# Altium schematic sheet pca10040_sheet5_power_supply.SchDoc: PCA10040 - Power Supply
size A4; Revision: 1.1.1; SheetNumber: 5; SheetTotal: 5; DrawnBy: KJP; ProjectNumber: 4397; PCBRevision: 0071KJP; DocumentSize: A4; PCAName: PCA10040; PCBNumber: 400150; ProjectName: Quark
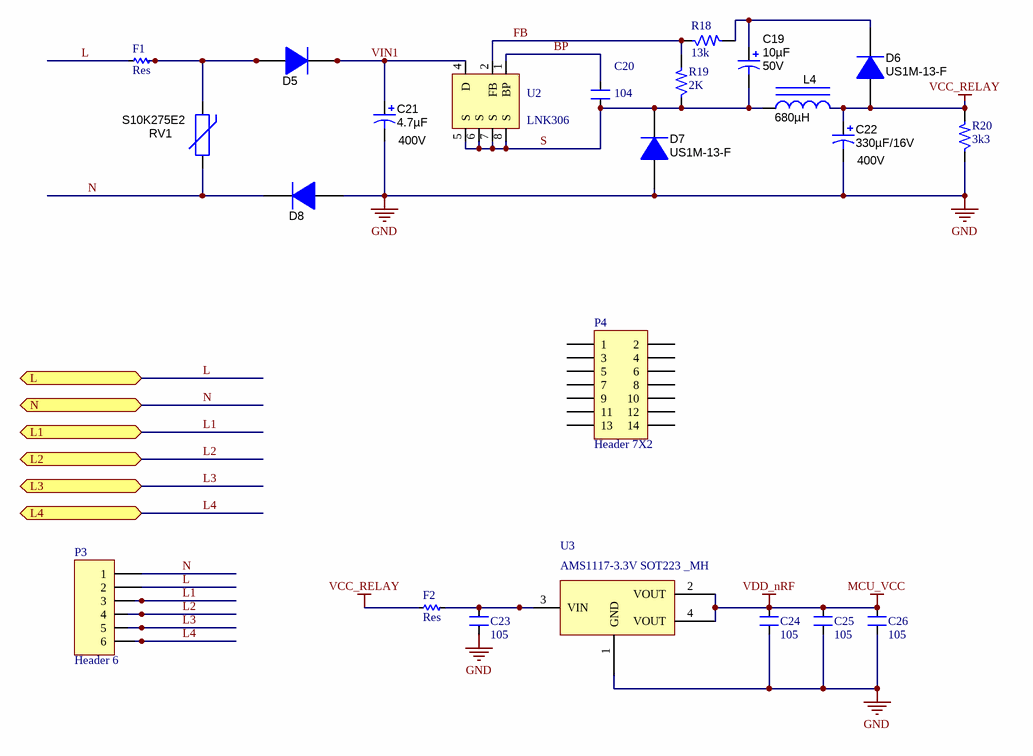
[diagram p0: pca10040_sheet5_power_supply.SchDoc]

## Parts
C19  ValueDisplayed: 10µF  Value2: 50V  [NHG_500x1100]  (hidden comment: ECA-1HHG100)
C20  104  [0805_HV]
C21  ValueDisplayed: 4.7µF  Value2: 400V  [PANACAP-G-GENERIC]  (hidden comment: 400AX6R8M8x11)
C22  ValueDisplayed: 330µF/16V  Value2: 400V  [CAPPRD350W60D800H1100]  (hidden comment: 400AX6R8M8x11)
C23  105  [0805_HV]
C24  105  [0805_HV]
C25  105  [0805_HV]
C26  105  [0805_HV]
D5  US1M-13-F  [SMB]  (value not drawn)
D6  US1M-13-F  [SMB]
D7  US1M-13-F  [SMB]
D8  US1M-13-F  [SMB]  (value not drawn)
F1  Res  [1206]
F2  Res  [1206]
L4  ValueDisplayed: 680µH  [IND_WE-TI_8095]  (hidden comment: 7447480331)
P3  Header 6  [CONWALL_SWITH-4]
P4  Header 7X2  [CON14_1.27]
R18  13k  [0805_HV]
R19  2K  [0805_HV]
R20  3k3  [0805_HV]
RV1  S10K275E2  [VAR_S10K275E2]
U2  LNK306  [SOP 7]
U3  AMS1117-3.3V SOT223 _MH  [SOT223]

## Ports
L1 (bidir), L2 (bidir), L3 (bidir), L4 (bidir), L (bidir), N (bidir)

## Nets
GND: C21.2(-) C22.2(-) C23.1 C24.1 C25.1 C26.1 D7.2(A) D8.2(A) R20.1 U3.1(GND)
MCU_VCC: C24.2 C25.2 C26.2 U3.2(VOUT) U3.4(VOUT)  [also labelled VDD_nRF]
VCC_RELAY: C22.1(+) D6.2(A) F2.2 L4.2 R20.2
BP: C20.2 U2.1(BP)
FB: R18.1 R19.2 U2.2(FB)
L: F1.2 P3.2 ; port L
L1: P3.3 ; port L1
L2: P3.4 ; port L2
L3: P3.5 ; port L3
L4: P3.6 ; port L4
N: D8.1(K) P3.1 RV1.1 ; port N
S: C19.2(-) C20.1 D7.1(K) L4.1 R19.1 U2.5(S) U2.6(S) U2.7(S) U2.8(S)
VIN1: C21.1(+) D5.1(K) U2.4(D)
NetC19_1: C19.1(+) D6.1(K) R18.2
NetC23_2: C23.2 F2.1 U3.3(VIN)
NetD5_2: D5.2(A) F1.1 RV1.2

Not connected (* = marked no-connect by the designer): P4 1 2 3 4 5 6 7 8 9 10 11 12 13 14

## Notes on the sheet
- Title
- Size
- Date:
- Project Number
- Sheet         of
- Revision
- File:
- Drawn By:

## Library data of the parts
C19 = ECA-1HHG100: CAP, AL, 10 µF, 50 V, +/- 20%, TH; Manufacturer: Panasonic; Polarized: Y; CompType: Capacitor; Value: 10uF; U/M: EA; Cap_F: 0.00001; Tolerance_%: 20; VDC_V: 50; IRMS_A: 0.039; TaMin_C: -55; TaMax_C: 105; Cap_Case: 5x11mm; SizeAreaWB_mm2: 49; SizeArea_mm2: 25; SizeX_mm: 5; SizeZ_mm: 12; AEC Category: Q200; AEC Qualified: N; SymbolVersion: 2008-07-09; PartNumber: ECA-1HHG100; PackageReference: D5xL11mm; RoHS: Y; MountType: TH; Technology: AL; Series: NHG; SizeY_mm: 5; Publisher: Texas Instruments; LatestRevisionDate: 2017-06-22; ComponentLink1Description: Datasheet link; ComponentLink1URL: https://industrial.panasonic.com/cdbs/www-data/pdf/RDF0000/ABA0000C75.pdf; Supplier 1: Digi-Key; Supplier Part Number 1: P5567-ND; Supplier 2: Newark; Supplier Part Number 2: 96K9161; Supplier 3: Mouser; Supplier Part Number 3: 667-ECA-1HHG100; AEC Grade: N/A
C20 C23-C26 = CM: Cap SMD; Value: 103
C21 C22 = 400AX6R8M8x11: CAP, AL, 6.8uF, 400V, +/-20%, TH; Manufacturer: Rubycon; Polarized: Y; CompType: Capacitor; U/M: EA; Cap_F: 0.0000068; Tolerance_%: 20; Value1: Unknown; VDC_V: 400; TaMin_C: -40; TaMax_C: 105; Cap_Case: 8x11; SymbolVersion: 2008-07-09; Value: 6.8uF; PartNumber: 400AX6R8M8x11; PackageReference: 8x11; RoHS: Y; MountType: TH; Technology: AL; Series: AX; Publisher: Texas Instruments; LatestRevisionDate: 2013-08-02; ComponentLink1Description: Datasheet link; ComponentLink1URL: http://www.rubycon.co.jp/de/catalog/e_pdfs/aluminum/e_ax.pdf
D5-D8 = MURS160-13-F: Diode, Ultrafast, 600V, 1A, SMB; Manufacturer: Diodes Inc.; U/M: EA; Vf_V: 1.25; Value2: 1.25V; Io_A: 1; Vr_V: 600; TJmax_C: 150; RJC_CperW: 13; PartNumber: US1M-13-F; CompType: Diode; SymbolVersion: 2008-12-08; MountType: SMT; RoHS: Y; Value: 600V; PackageReference: SMB; Value1: 1A; Type: Ultrafast; Published: 2008-06-26; Publisher: Texas Instruments; LatestRevisionDate: 2013-06-21; ComponentLink1Description: Datasheet link; ComponentLink1URL: http://www.diodes.com/datasheets/ds30130.pdf; Supplier 1: Digi-Key; Supplier 2: Mouser; Supplier 3: Farnell
F1 F2 = Res-SMD: Resistor; Manufacturer: Generic Components; Class: Passive; Published: 08/06/2000; Publisher: Altium Hobart Technology Centre
L4 = 7447480331: Inductor, Wirewound, Ferrite, 330 µH, 1.4 A, 0.3 ohm, TH; Manufacturer: Wurth Elektronik; Value: 330uH; Ind_H: 330.0E-6; Imax_A: 1.4; Irms: 1.4A @ 40C rise; Isat: 1.6A @ 10% inductance drop; DCR_ohm: 0.3; Value1: 0.3 ohm; Value2: 1.4A; AEC Category: Q200; AEC Qualified: N; SymbolVersion: 2008-07-23; CompType: Inductor; PartNumber: 7447480331; Technology: Wirewound; MountType: TH; Material: Ferrite; PackageReference: TH, Dia 10.5mm; Published: 2008-06-26; Publisher: Texas Instruments; LatestRevisionDate: 2016-06-15; ComponentLink1Description: Datasheet link; ComponentLink1URL: http://katalog.we-online.de/pbs/datasheet/7447480331.pdf; RoHS: Y; Supplier 1: Digi-Key; Supplier Part Number 1: 732-4196-ND; Supplier 2: Mouser; Supplier Part Number 2: 710-7447480331; Supplier 3: Farnell; Supplier Part Number 3: 2211733; AEC Grade: N/A
P3 = Header 6: Header, 6-Pin; LatestRevisionDate: 17-Jul-2002; LatestRevisionNote: Re-released for DXP Platform.; Publisher: Altium Limited
P4 = Header 7X2: Header, 7-Pin, Dual row; LatestRevisionDate: 17-Jul-2002; LatestRevisionNote: Re-released for DXP Platform.; Publisher: Altium Limited
R18-R20 = R: Resistor 1/4W; Value: R1/4W - 1K
RV1 = S10K275E2: Varistor 275V RMS 10MM Radial, TH; Manufacturer: EPCOS Inc; SymbolCreator: a0412235; SymbolVersion: 2012-06-04; PartNumber: S10K275E2; MountType: TH; ComponentLink1Description: Datasheet URL; ComponentLink1URL: http://www.epcos.com/inf/70/db/var_08/SIOV_Leaded_AdvanceD.pdf; RoHS: Y; PackageReference: 10mm Radial; Publisher: Texas Instruments; LatestRevisionDate: 2013-02-24; Supplier 1: Digi-Key; Supplier Part Number 1: 495-1433-ND
U2 = Component_1